# EAGLE design ROM-el HN61256 (EAGLE 7.7.0)
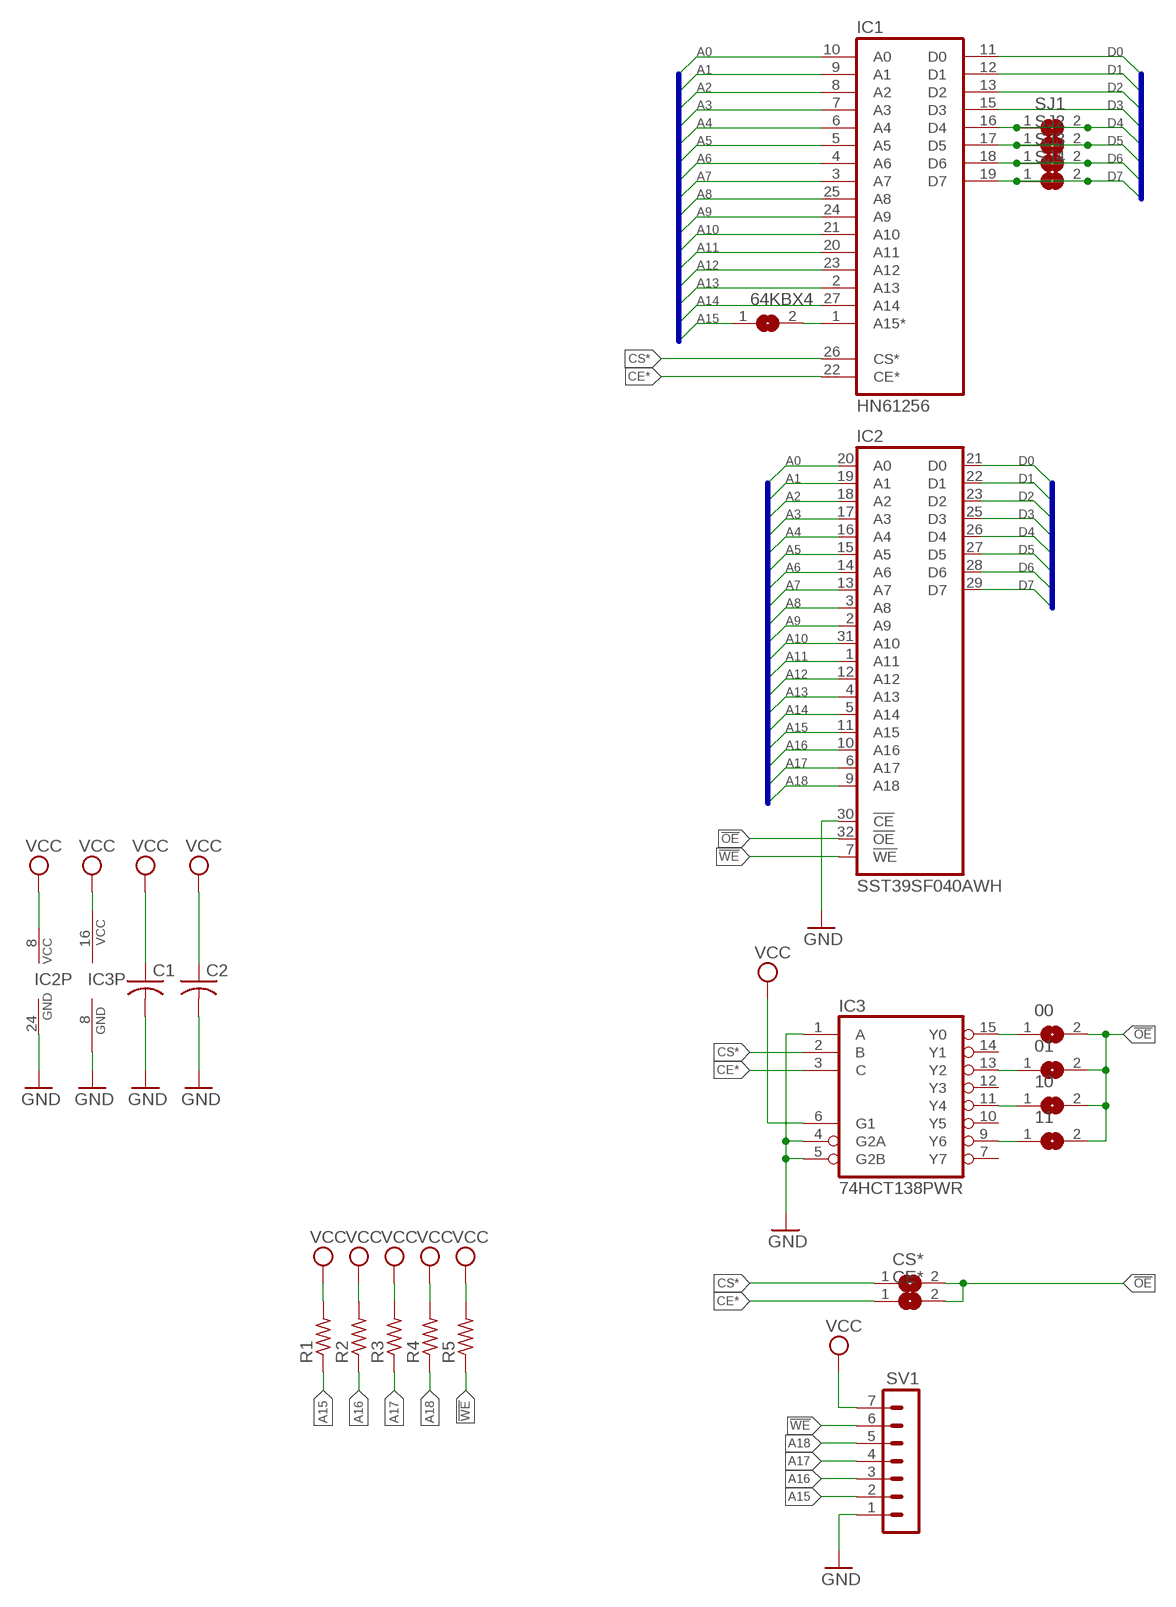
[diagram p0: schematic, sheet 1]

## Parts
00  SJ  [SJ]
01  SJ  [SJ]
10  SJ  [SJ]
11  SJ  [SJ]
64KBX4  SJ  [SJ]
C1  C-USC0402  [C0402]
C2  C-USC0402  [C0402]
CE*  SJ  [SJ]
CS*  SJ  [SJ]
IC1  HN61256  [DIL28-6]
IC2  SST39SF040AWH  [VSOP32]
IC3  74HCT138PWR  [TSSOP16]
R1  R-US_R0402  [R0402]
R2  R-US_R0402  [R0402]
R3  R-US_R0402  [R0402]
R4  R-US_R0402  [R0402]
R5  R-US_R0402  [R0402]
SJ1  SJ  [SJ]
SJ2  SJ  [SJ]
SJ3  SJ  [SJ]
SJ4  SJ  [SJ]
SV1  MA07-1  [MA07-1]

## Nets
!OE: 00.2 01.2 10.2 11.2 CE*.2 CS*.2 IC2.32(!OE)
!WE: IC2.7(!WE) R5.1 SV1.6
A0: IC1.10(A0) IC2.20(A0)
A1: IC1.9(A1) IC2.19(A1)
A2: IC1.8(A2) IC2.18(A2)
A3: IC1.7(A3) IC2.17(A3)
A4: IC1.6(A4) IC2.16(A4)
A5: IC1.5(A5) IC2.15(A5)
A6: IC1.4(A6) IC2.14(A6)
A7: IC1.3(A7) IC2.13(A7)
A8: IC1.25(A8) IC2.3(A8)
A9: IC1.24(A9) IC2.2(A9)
A10: IC1.21(A10) IC2.31(A10)
A11: IC1.20(A11) IC2.1(A11)
A12: IC1.23(A12) IC2.12(A12)
A13: IC1.2(A13) IC2.4(A13)
A14: IC1.27(A14) IC2.5(A14)
A15: 64KBX4.1 IC2.11(A15) R1.1 SV1.2
A16: IC2.10(A16) R2.1 SV1.3
A17: IC2.6(A17) R3.1 SV1.4
A18: IC2.9(A18) R4.1 SV1.5
CE*: CE*.1 IC1.22(CE*) IC3.3(C)
CS*: CS*.1 IC1.26(CS*) IC3.2(B)
D0: IC1.11(D0) IC2.21(D0)
D1: IC1.12(D1) IC2.22(D1)
D2: IC1.13(D2) IC2.23(D2)
D3: IC1.15(D3) IC2.25(D3)
D4: IC1.16(D4) IC2.26(D4) SJ1.1 SJ1.2
D5: IC1.17(D5) IC2.27(D5) SJ2.1 SJ2.2
D6: IC1.18(D6) IC2.28(D6) SJ3.1 SJ3.2
D7: IC1.19(D7) IC2.29(D7) SJ4.1 SJ4.2
GND: C1.2 C2.2 IC2.24(GND) IC2.30(!CE) IC3.1(A) IC3.4(G2A) IC3.5(G2B) IC3.8(GND) SV1.1
N$1: 64KBX4.2 IC1.1(A15*)
N$2: 11.1 IC3.9(Y6)
N$3: 10.1 IC3.11(Y4)
N$4: 01.1 IC3.13(Y2)
N$6: 00.1 IC3.15(Y0)
VCC: C1.1 C2.1 IC2.8(VCC) IC3.6(G1) IC3.16(VCC) R1.2 R2.2 R3.2 R4.2 R5.2 SV1.7
Unconnected: IC3.7(Y7) IC3.10(Y5) IC3.12(Y3) IC3.14(Y1)

## Buses
A[0..18]
D[0..7]

## Power pins joined to a net without a drawn wire
GND: IC1.14(GND)
VCC: IC1.28(VCC)

## Library data of the parts
00 01 10 11 64KBX4 CE* CS* SJ1-SJ4 = jumper-jlb:SJ: SMD solder JUMPER
C1 C2 = rcl:C-US: CAPACITOR, American symbol
IC1 = memory-hitachi-jlb:HN61256
IC2 = memory-sst:SST39SF040A: 4 Mbit x8 Multi-Purpose Flash Source: http://www.sst.com/dotAsset/40782.pdf
IC3 = 74xx-us-jlb:74*138: 3-line to 8-line DECODER/DEMULTIPLEXER
R1-R5 = resistor:R-US_: RESISTOR, American symbol
SV1 = con-lstb-rp:MA07-1: PIN HEADER; OC_FARNELL: unknown; OC_NEWARK: unknown

## Board
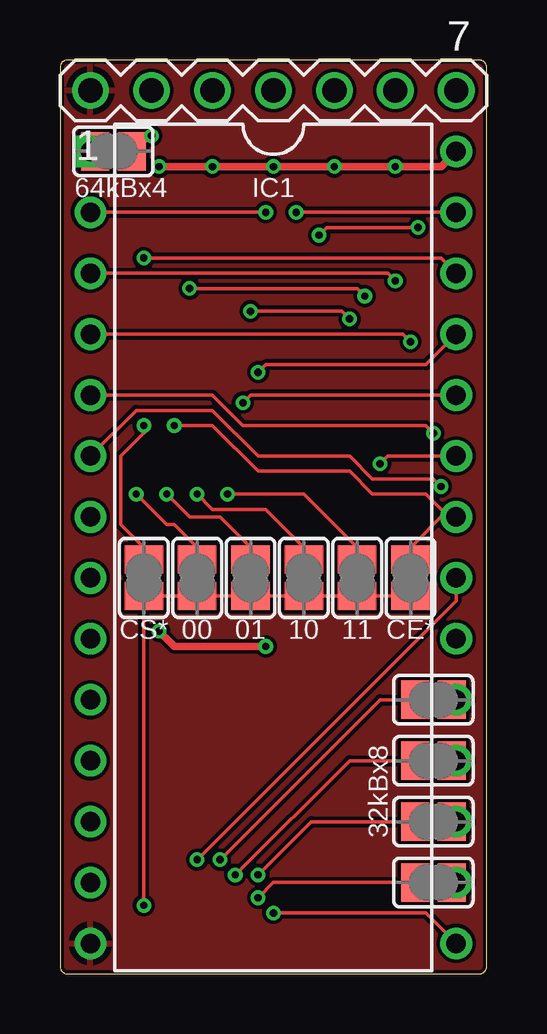
[diagram p1: board, top side]
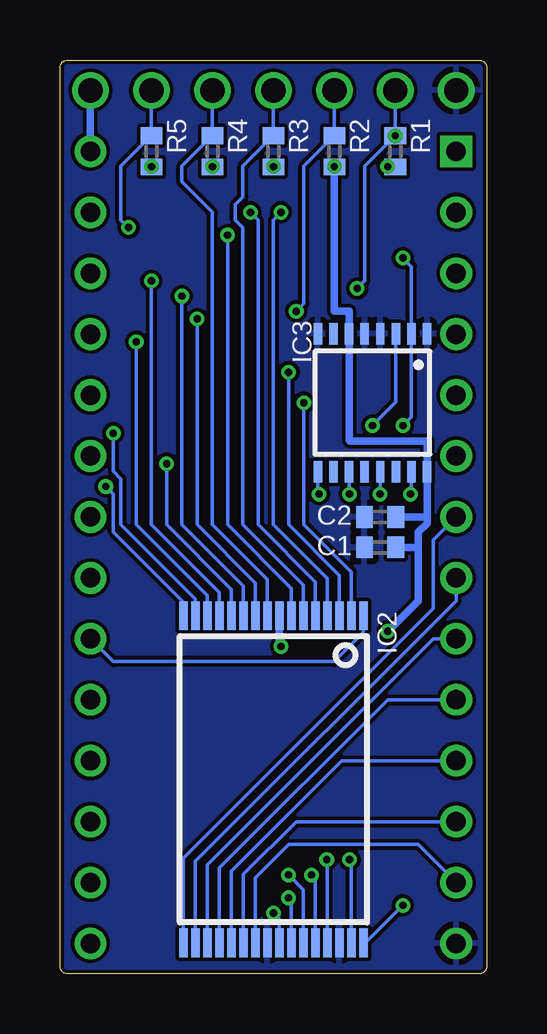
[diagram p2: board, bottom side, seen from below]

Size 17.78 x 38.1 mm. Coordinates in mm from the lower left corner, seen from the top.
Outline: 0,37.78 0,0.32 arc90 0.32,0 17.46,0 arc90 17.78,0.32 17.78,37.78 arc90 17.46,38.1 0.32,38.1 arc90 0,37.78
Copper layers (1*16): Top 0.035mm / dielectric 1.5mm / Bottom 0.035mm
Design rules "hackvana": minimum track width 6mil, minimum drill 0.3mm, track to track 6mil, track to pad 6mil, pad to pad 6mil, via to via 6mil, smd to smd 0mil, copper to edge 6mil, drill to drill 6mil, minimum pad ring 10mil, minimum via ring 6mil, stop-mask expansion 2mil, vias tented up to drill 100mil, thermal gap 10mil

### Footprints (pad centres in the part's own frame; a part is rotated, then mirrored left to right if it is on the bottom)
SJ = smd 1.168 x 1.6: 1 -0.762,0; 2 0.762,0
C0402 = smd 0.7 x 0.9: 1 -0.65,0; 2 0.65,0
DIL28-6 = drill 0.813 square: 1 -16.51,-7.62 | drill 0.813: 2 -13.97,-7.62; 3 -11.43,-7.62; 4 -8.89,-7.62; 5 -6.35,-7.62; 6 -3.81,-7.62; 7 -1.27,-7.62; 8 1.27,-7.62; 9 3.81,-7.62; 10 6.35,-7.62; 11 8.89,-7.62; 12 11.43,-7.62; 13 13.97,-7.62; 14 16.51,-7.62; 15 16.51,7.62; 16 13.97,7.62; 17 11.43,7.62; 18 8.89,7.62; 19 6.35,7.62; 20 3.81,7.62; 21 1.27,7.62; 22 -1.27,7.62; 23 -3.81,7.62; 24 -6.35,7.62; 25 -8.89,7.62; 26 -11.43,7.62; 27 -13.97,7.62; 28 -16.51,7.62
VSOP32 = smd 1.2 x 0.36: 1 -7.31,3.75; 2 -7.31,3.25; 3 -7.31,2.75; 4 -7.31,2.25; 5 -7.31,1.75; 6 -7.31,1.25; 7 -7.31,0.75; 8 -7.31,0.25; 9 -7.31,-0.25; 10 -7.31,-0.75; 11 -7.31,-1.25; 12 -7.31,-1.75; 13 -7.31,-2.25; 14 -7.31,-2.75; 15 -7.31,-3.25; 16 -7.31,-3.75; 17 6.322,-3.75; 18 6.322,-3.25; 19 6.322,-2.75; 20 6.322,-2.25; 21 6.322,-1.75; 22 6.322,-1.25; 23 6.322,-0.75; 24 6.322,-0.25; 25 6.322,0.25; 26 6.322,0.75; 27 6.322,1.25; 28 6.322,1.75; 29 6.322,2.25; 30 6.322,2.75; 31 6.322,3.25; 32 6.322,3.75
TSSOP16 = smd 0.9 x 0.35: 1 -2.875,2.275; 2 -2.875,1.625; 3 -2.875,0.975; 4 -2.875,0.325; 5 -2.875,-0.325; 6 -2.875,-0.975; 7 -2.875,-1.625; 8 -2.875,-2.275; 9 2.875,-2.275; 10 2.875,-1.625; 11 2.875,-0.975; 12 2.875,-0.325; 13 2.875,0.325; 14 2.875,0.975; 15 2.875,1.625; 16 2.875,2.275
R0402 = smd 0.7 x 0.9: 1 -0.65,0; 2 0.65,0
MA07-1 = drill 1.016: 1 -7.62,0; 2 -5.08,0; 3 -2.54,0; 4 0,0; 5 2.54,0; 6 5.08,0; 7 7.62,0

### Placement (x,y rotation side)
00  5.72,16.51 270 top
01  7.94,16.51 270 top
10  10.16,16.51 270 top
11  12.38,16.51 270 top
64KBX4  2.22,34.29 180 top
C1  4.45,17.78 180 bottom
C2  4.45,19.05 180 bottom
CE*  14.61,16.51 270 top
CS*  3.49,16.51 270 top
IC1  8.89,17.78 270 top
IC2  8.89,7.62 270 bottom
IC3  4.76,23.81 270 bottom
R1  3.81,34.29 270 bottom
R2  6.35,34.29 270 bottom
R3  8.89,34.29 270 bottom
R4  11.43,34.29 270 bottom
R5  13.97,34.29 270 bottom
SJ1  15.56,3.81 180 top
SJ2  15.56,6.35 180 top
SJ3  15.56,8.89 180 top
SJ4  15.56,11.43 180 top
SV1  8.89,36.83 0 top

### Tracks (layer width: path | path; a pad name or v marks a point on that pad's centre or on a via)
!OE  (via drill 0.3)
  Top 0.152: v3.49,2.86 CS*.2 00.2 01.2 10.2 11.2 CE*.2
  Bottom 0.152: IC2.32 5.05,1.3 v3.49,2.86
!WE  (via drill 0.3)
  Top 0.152: v10.79,30.8 11.11,31.11 v14.92,31.11
  Bottom 0.152: IC2.7 8.14,16.08 10.79,18.73 v10.79,30.8 | SV1.6 R5.1 15.24,33.67 15.24,31.43 v14.92,31.11
A0
  Bottom 0.152: IC2.20 11.14,4.42 4.13,11.43 IC1.10
A1
  Bottom 0.152: IC2.19 11.64,4.55 2.22,13.97 IC1.9
A2
  Bottom 0.152: IC2.18 12.14,4.69 1.27,15.56 IC1.8
A3
  Bottom 0.152: IC2.17 12.64,4.82 2.22,15.24 2.22,18.1 IC1.7
A4  (via drill 0.3)
  Top 0.152: v15.88,20.32 15.56,20.64 13.02,20.64 12.07,21.59 8.26,21.59 6.35,23.5 3.18,23.5 IC1.6
  Bottom 0.152: IC2.16 12.64,15.5 15.56,18.41 15.56,20 v15.88,20.32
A5  (via drill 0.3)
  Top 0.152: IC1.5 6.35,24.13 7.62,22.86 15.24,22.86 v15.56,22.54
  Bottom 0.152: IC2.15 12.14,15.63 15.24,18.73 15.24,20.64 15.56,20.95 v15.56,22.54
A6  (via drill 0.3)
  Top 0.152: IC1.4 14.29,26.67 v14.61,26.35
  Bottom 0.152: IC2.14 11.64,15.77 14.61,18.73 v14.61,26.35
A7  (via drill 0.3)
  Top 0.152: IC1.3 13.65,29.21 v13.97,28.89
  Bottom 0.152: IC2.13 11.14,15.9 13.97,18.73 v13.97,28.89
A8  (via drill 0.3)
  Top 0.152: IC1.25 15.24,25.4 8.57,25.4 v8.26,25.08
  Bottom 0.152: IC2.3 6.14,16.62 8.26,18.73 v8.26,25.08
A9  (via drill 0.3)
  Top 0.152: IC1.24 7.94,24.13 v7.62,23.81
  Bottom 0.152: v7.62,23.81 7.62,18.73 5.64,16.75 IC2.2
A10  (via drill 0.3)
  Top 0.152: v5.72,4.76 16.51,15.56 IC1.21
  Bottom 0.152: IC2.31 5.64,4.69 v5.72,4.76
A11
  Bottom 0.152: IC2.1 5.14,14.23 6.35,13.02 15.56,13.02 IC1.20
A12  (via drill 0.3)
  Top 0.152: v13.34,21.27 13.65,21.59 IC1.23
  Bottom 0.152: IC2.12 10.64,16.04 13.34,18.73 v13.34,21.27
A13  (via drill 0.3)
  Top 0.152: IC1.2 v8.57,31.75
  Bottom 0.152: IC2.4 6.64,16.48 8.89,18.73 8.89,31.43 v8.57,31.75
A14  (via drill 0.3)
  Top 0.152: IC1.27 v9.84,31.75
  Bottom 0.152: IC2.5 7.14,16.35 9.53,18.73 9.53,31.43 v9.84,31.75
A15  (via drill 0.3)
  Top 0.152: v12.7,28.26 12.38,28.57 v5.4,28.57 | 64KBX4.1 3.16,34.29 R1.1
  Bottom 0.152: IC2.11 10.14,16.17 12.7,18.73 v12.7,28.26 | v5.4,28.57 5.08,28.89 5.08,33.67 R1.1 SV1.2
  other vias: 3.81,34.94
A16  (via drill 0.3)
  Top 0.152: v12.07,27.3 11.75,27.62 v7.94,27.62
  Bottom 0.152: IC2.10 9.64,16.31 12.07,18.73 v12.07,27.3 | SV1.3 R2.1 7.62,33.67 7.62,27.94 v7.94,27.62
A17
  Bottom 0.152: IC2.6 7.64,16.21 10.16,18.73 10.16,31.11 10.48,31.43 10.48,32.07 10.16,32.38 10.16,33.67 R3.1 SV1.4
A18
  Bottom 0.152: IC2.9 9.14,16.44 11.43,18.73 11.43,31.75 12.7,33.02 12.7,33.67 R4.1 SV1.5
CE*  (via drill 0.3)
  Top 0.152: IC1.22 16.19,19.05 16.03,19.21 | 16.03,19.21 15.24,20 13.02,20 12.07,20.95 8.26,20.95 6.35,22.86 v4.76,22.86 | CE*.1 14.61,17.78 16.03,19.21
  Bottom 0.152: v4.76,22.86 3.79,23.84 IC3.3
CS*  (via drill 0.3)
  Top 0.152: IC1.26 15.88,29.84 v3.49,29.84 | v3.49,22.86 3.49,22.54 2.54,21.59 2.54,18.73 3.49,17.78 CS*.1
  Bottom 0.152: v3.49,29.84 3.14,29.49 IC3.2 3.14,23.21 v3.49,22.86
D0
  Bottom 0.152: IC2.21 10.64,4.28 6.03,8.89 IC1.11
D1
  Bottom 0.152: IC2.22 10.14,4.15 7.94,6.35 IC1.12
D2
  Bottom 0.152: IC2.23 9.64,4.01 8.26,5.4 2.86,5.4 IC1.13
D3  (via drill 0.3)
  Top 0.152: v8.89,2.54 15.24,2.54 IC1.15
  Bottom 0.152: IC2.25 8.64,2.29 v8.89,2.54
D4  (via drill 0.3)
  Top 0.152: v8.26,3.17 8.89,3.81 SJ1.2 SJ1.1 IC1.16
  Bottom 0.152: IC2.26 8.14,3.06 v8.26,3.17
D5  (via drill 0.3)
  Top 0.152: v8.26,4.13 10.48,6.35 SJ2.2 SJ2.1 IC1.17
  Bottom 0.152: IC2.27 7.64,3.51 v8.26,4.13
D6  (via drill 0.3)
  Top 0.152: v7.3,4.13 12.07,8.89 SJ3.2 SJ3.1 IC1.18
  Bottom 0.152: IC2.28 7.14,3.96 v7.3,4.13
D7  (via drill 0.3)
  Top 0.152: v6.67,4.76 13.34,11.43 SJ4.2 SJ4.1 IC1.19
  Bottom 0.152: IC2.29 6.64,4.74 v6.67,4.76
GND
  pour Top: 17.78,37.78 17.78,0.32 arc-90 17.46,0 0.32,0 arc-90 0,0.32 0,37.78 arc-90 0.32,38.1 17.46,38.1 arc-90
  pour Bottom: 17.78,37.78 17.78,0.32 arc-90 17.46,0 0.32,0 arc-90 0,0.32 0,37.78 arc-90 0.32,38.1 17.46,38.1 arc-90
N$1
  Top 0.152: 1.91,34.29 64KBX4.2 IC1.1
N$2  (via drill 0.3)
  Top 0.152: v6.99,20 10.16,20 12.38,17.78 11.1
  Bottom 0.152: IC3.9 7.04,20.05 v6.99,20
N$3  (via drill 0.3)
  Top 0.152: v5.72,20 6.35,19.37 8.57,19.37 10.16,17.78 10.1
  Bottom 0.152: IC3.11 5.74,20.02 v5.72,20
N$4  (via drill 0.3)
  Top 0.152: v4.45,20 5.4,19.05 6.67,19.05 7.94,17.78 01.1
  Bottom 0.152: IC3.13 v4.44,20.01 v4.45,20
N$6  (via drill 0.3)
  Top 0.152: v3.18,20 4.45,18.73 4.76,18.73 5.72,17.78 00.1
  Bottom 0.152: IC3.15 3.14,20.04 v3.18,20
VCC  (via drill 0.3)
  Top 0.305: v4.13,33.66 v6.35,33.66 v8.89,33.66 v11.43,33.66 v13.97,33.66 15.88,33.66 IC1.28 | v8.57,13.65 4.76,13.65 v4.13,14.29
  Bottom 0.152: R1.2 4.11,33.64 v4.13,33.66 | R5.2 v13.97,33.66 | R4.2 v11.43,33.66 | R3.2 v8.89,33.66 | R2.2 v6.35,33.66
  Bottom 0.305: IC2.8 8.64,13.72 v8.57,13.65 | v4.13,14.29 2.86,15.56 2.86,17.78 | 2.86,17.78 2.86,18.41 2.49,18.79 2.49,19.05 | 2.49,19.05 IC3.16 2.49,22.23 5.72,22.23 5.74,22.25 IC3.6 5.74,27.62 6.35,27.62 v6.35,33.66 | IC1.28 SV1.7 | C1.1 2.86,17.78 | C2.1 2.49,19.05

### Text on the board
tNames: 64kBx4 | 32kBx8